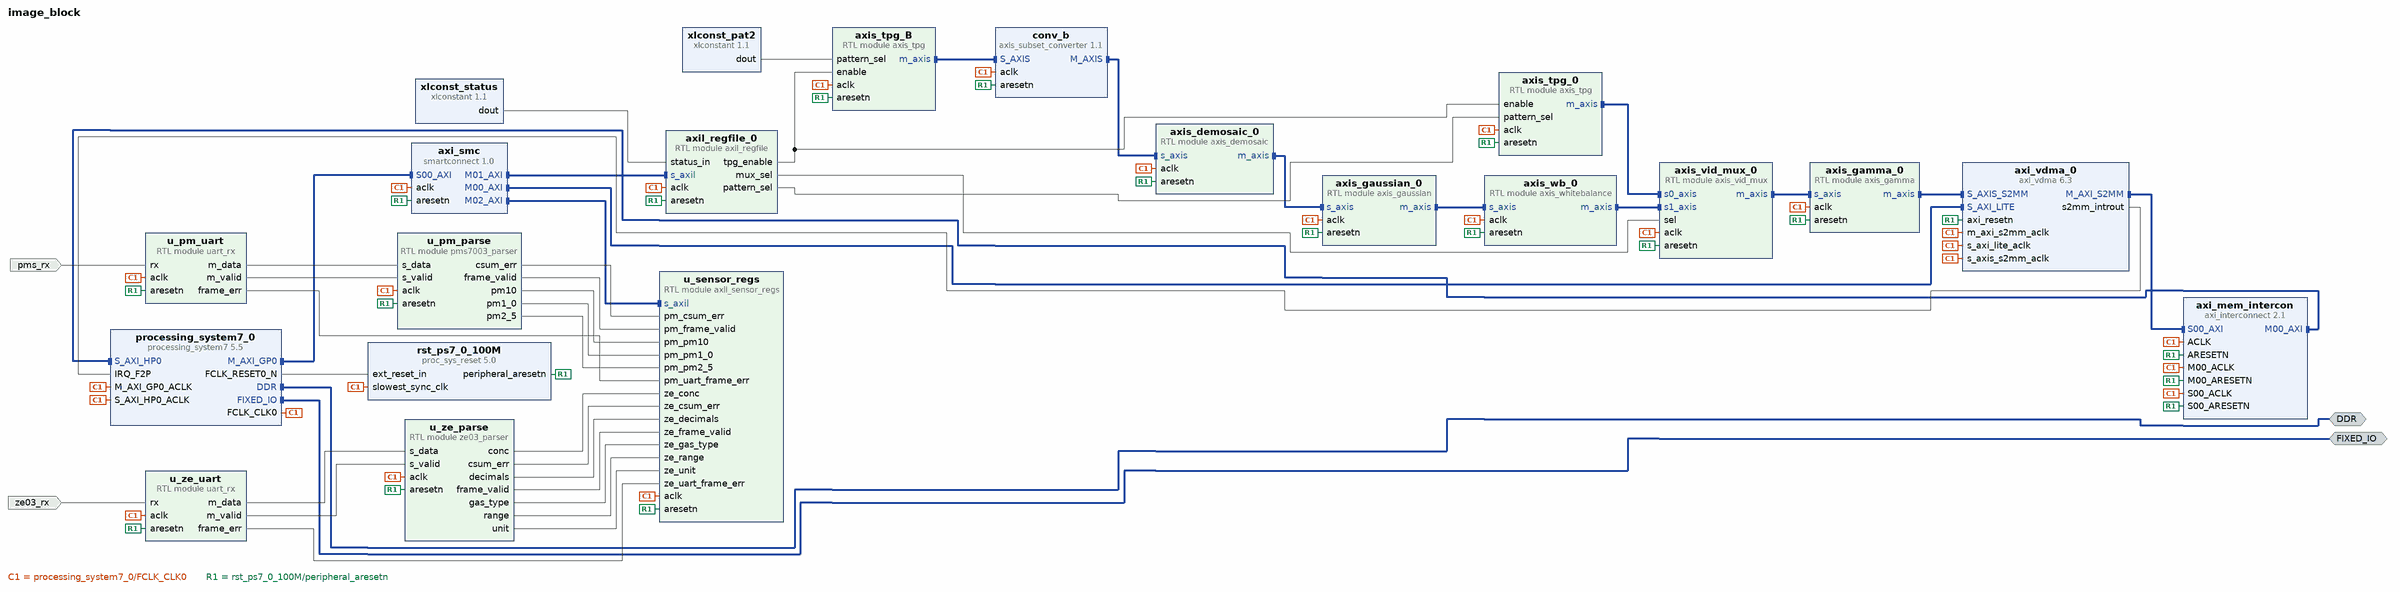
[diagram p0: block diagram of the top level]
# Vivado block design image_block, xc7z020clg400-1, Vivado 2025.2
create_bd_design image_block

create_bd_intf_port -mode Master -vlnv xilinx.com:interface:ddrx_rtl:1.0 DDR
create_bd_intf_port -mode Master -vlnv xilinx.com:display_processing_system7:fixedio_rtl:1.0 FIXED_IO
create_bd_port -dir I ze03_rx
create_bd_port -dir I pms_rx

create_bd_cell -type ip -vlnv xilinx.com:ip:processing_system7:5.5 processing_system7_0
set_property -dict [list \
  CONFIG.PCW_APU_PERIPHERAL_FREQMHZ 666.666666 \
  CONFIG.PCW_ENET0_ENET0_IO {MIO 16 .. 27} \
  CONFIG.PCW_ENET0_GRP_MDIO_ENABLE 1 \
  CONFIG.PCW_ENET0_GRP_MDIO_IO {MIO 52 .. 53} \
  CONFIG.PCW_ENET0_PERIPHERAL_ENABLE 1 \
  CONFIG.PCW_ENET0_RESET_ENABLE 0 \
  CONFIG.PCW_ENET_RESET_ENABLE 1 \
  CONFIG.PCW_ENET_RESET_SELECT {Share reset pin} \
  CONFIG.PCW_FPGA0_PERIPHERAL_FREQMHZ 100 \
  CONFIG.PCW_GPIO_MIO_GPIO_ENABLE 1 \
  CONFIG.PCW_GPIO_MIO_GPIO_IO MIO \
  CONFIG.PCW_I2C0_GRP_INT_ENABLE 0 \
  CONFIG.PCW_I2C0_I2C0_IO {MIO 10 .. 11} \
  CONFIG.PCW_I2C0_PERIPHERAL_ENABLE 1 \
  CONFIG.PCW_I2C_PERIPHERAL_FREQMHZ 111.111115 \
  CONFIG.PCW_I2C_RESET_ENABLE 1 \
  CONFIG.PCW_I2C_RESET_SELECT {Share reset pin} \
  CONFIG.PCW_IRQ_F2P_INTR 1 \
  CONFIG.PCW_PRESET_BANK1_VOLTAGE {LVCMOS 1.8V} \
  CONFIG.PCW_QSPI_GRP_FBCLK_ENABLE 1 \
  CONFIG.PCW_QSPI_GRP_FBCLK_IO {MIO 8} \
  CONFIG.PCW_QSPI_GRP_SINGLE_SS_ENABLE 1 \
  CONFIG.PCW_QSPI_GRP_SINGLE_SS_IO {MIO 1 .. 6} \
  CONFIG.PCW_QSPI_PERIPHERAL_ENABLE 1 \
  CONFIG.PCW_QSPI_QSPI_IO {MIO 1 .. 6} \
  CONFIG.PCW_SD0_GRP_CD_ENABLE 1 \
  CONFIG.PCW_SD0_GRP_CD_IO {MIO 47} \
  CONFIG.PCW_SD0_GRP_WP_ENABLE 0 \
  CONFIG.PCW_SD0_PERIPHERAL_ENABLE 1 \
  CONFIG.PCW_SD0_SD0_IO {MIO 40 .. 45} \
  CONFIG.PCW_SDIO_PERIPHERAL_FREQMHZ 50 \
  CONFIG.PCW_SINGLE_QSPI_DATA_MODE x4 \
  CONFIG.PCW_UART1_PERIPHERAL_ENABLE 1 \
  CONFIG.PCW_UART1_UART1_IO {MIO 48 .. 49} \
  CONFIG.PCW_UART_PERIPHERAL_FREQMHZ 100 \
  CONFIG.PCW_UIPARAM_DDR_FREQ_MHZ 533.333333 \
  CONFIG.PCW_UIPARAM_DDR_MEMORY_TYPE {DDR 3 (Low Voltage)} \
  CONFIG.PCW_UIPARAM_DDR_PARTNO {MT41K256M16 RE-125} \
  CONFIG.PCW_USB0_PERIPHERAL_ENABLE 1 \
  CONFIG.PCW_USB0_RESET_ENABLE 1 \
  CONFIG.PCW_USB0_RESET_IO {MIO 46} \
  CONFIG.PCW_USB0_USB0_IO {MIO 28 .. 39} \
  CONFIG.PCW_USB_RESET_ENABLE 1 \
  CONFIG.PCW_USB_RESET_SELECT {Share reset pin} \
  CONFIG.PCW_USE_FABRIC_INTERRUPT 1 \
  CONFIG.PCW_USE_S_AXI_HP0 1 \
] [get_bd_cells processing_system7_0]
# 298 more settings of processing_system7_0 are not shown: defaults, MIO pin electricals, DDR timing, and values the tool derives
create_bd_cell -type module -reference axis_tpg axis_tpg_0
set_property -dict {CONFIG.H_ACTIVE 64 CONFIG.V_ACTIVE 48} [get_bd_cells axis_tpg_0]
create_bd_cell -type ip -vlnv xilinx.com:ip:axi_vdma:6.3 axi_vdma_0
set_property -dict [list \
  CONFIG.c_addr_width 32 \
  CONFIG.c_include_mm2s 0 \
  CONFIG.c_include_s2mm 1 \
  CONFIG.c_m_axi_s2mm_data_width 64 \
] [get_bd_cells axi_vdma_0]
create_bd_cell -type ip -vlnv xilinx.com:ip:smartconnect:1.0 axi_smc
set_property -dict {CONFIG.NUM_MI 3 CONFIG.NUM_SI 1} [get_bd_cells axi_smc]
create_bd_cell -type ip -vlnv xilinx.com:ip:proc_sys_reset:5.0 rst_ps7_0_100M
create_bd_cell -type ip -vlnv xilinx.com:ip:axi_interconnect:2.1 axi_mem_intercon
set_property -dict {CONFIG.NUM_MI 1} [get_bd_cells axi_mem_intercon]
create_bd_cell -type module -reference axil_regfile axil_regfile_0
set_property -dict {CONFIG.ADDR_WIDTH 12} [get_bd_cells axil_regfile_0]
create_bd_cell -type ip -vlnv xilinx.com:ip:xlconstant:1.1 xlconst_status
set_property -dict {CONFIG.CONST_VAL 0 CONFIG.CONST_WIDTH 32} [get_bd_cells xlconst_status]
create_bd_cell -type module -reference axis_tpg axis_tpg_B
set_property -dict {CONFIG.H_ACTIVE 64 CONFIG.V_ACTIVE 48} [get_bd_cells axis_tpg_B]
create_bd_cell -type module -reference axis_demosaic axis_demosaic_0
set_property -dict {CONFIG.H_ACTIVE 64 CONFIG.V_ACTIVE 48} [get_bd_cells axis_demosaic_0]
create_bd_cell -type module -reference axis_vid_mux axis_vid_mux_0
create_bd_cell -type module -reference axis_gamma axis_gamma_0
set_property -dict {CONFIG.LUT_FILE C:/Users/user/Desktop/project/BARN_AI_FPGA_PL/rtl/gamma_lut.mem} [get_bd_cells axis_gamma_0]
create_bd_cell -type ip -vlnv xilinx.com:ip:xlconstant:1.1 xlconst_pat2
set_property -dict {CONFIG.CONST_VAL 2 CONFIG.CONST_WIDTH 2} [get_bd_cells xlconst_pat2]
create_bd_cell -type ip -vlnv xilinx.com:ip:axis_subset_converter:1.1 conv_b
set_property -dict [list \
  CONFIG.M_HAS_TKEEP 0 \
  CONFIG.M_HAS_TLAST 1 \
  CONFIG.M_HAS_TREADY 1 \
  CONFIG.M_HAS_TSTRB 0 \
  CONFIG.M_TDATA_NUM_BYTES 1 \
  CONFIG.M_TDEST_WIDTH 0 \
  CONFIG.M_TID_WIDTH 0 \
  CONFIG.M_TUSER_WIDTH 1 \
  CONFIG.S_HAS_TKEEP 0 \
  CONFIG.S_HAS_TLAST 1 \
  CONFIG.S_HAS_TREADY 1 \
  CONFIG.S_HAS_TSTRB 0 \
  CONFIG.S_TDATA_NUM_BYTES 3 \
  CONFIG.S_TDEST_WIDTH 0 \
  CONFIG.S_TID_WIDTH 0 \
  CONFIG.S_TUSER_WIDTH 1 \
  CONFIG.TDATA_REMAP {tdata[7:0]} \
] [get_bd_cells conv_b]
create_bd_cell -type module -reference axis_gaussian axis_gaussian_0
set_property -dict {CONFIG.H_ACTIVE 64 CONFIG.V_ACTIVE 48} [get_bd_cells axis_gaussian_0]
create_bd_cell -type module -reference axis_whitebalance axis_wb_0
create_bd_cell -type module -reference uart_rx u_ze_uart
create_bd_cell -type module -reference uart_rx u_pm_uart
create_bd_cell -type module -reference ze03_parser u_ze_parse
create_bd_cell -type module -reference pms7003_parser u_pm_parse
create_bd_cell -type module -reference axil_sensor_regs u_sensor_regs
set_property -dict {CONFIG.ADDR_WIDTH 12} [get_bd_cells u_sensor_regs]

# ---- connections ----

connect_bd_intf_net [get_bd_intf_pins axi_mem_intercon/M00_AXI] [get_bd_intf_pins processing_system7_0/S_AXI_HP0]
connect_bd_intf_net [get_bd_intf_pins axi_smc/M00_AXI] [get_bd_intf_pins axi_vdma_0/S_AXI_LITE]
connect_bd_intf_net [get_bd_intf_pins axi_smc/M01_AXI] [get_bd_intf_pins axil_regfile_0/s_axil]
connect_bd_intf_net [get_bd_intf_pins axi_smc/M02_AXI] [get_bd_intf_pins u_sensor_regs/s_axil]
connect_bd_intf_net [get_bd_intf_pins axi_vdma_0/M_AXI_S2MM] [get_bd_intf_pins axi_mem_intercon/S00_AXI]
connect_bd_intf_net [get_bd_intf_pins axis_demosaic_0/m_axis] [get_bd_intf_pins axis_gaussian_0/s_axis]
connect_bd_intf_net [get_bd_intf_pins axis_gamma_0/m_axis] [get_bd_intf_pins axi_vdma_0/S_AXIS_S2MM]
connect_bd_intf_net [get_bd_intf_pins axis_gaussian_0/m_axis] [get_bd_intf_pins axis_wb_0/s_axis]
connect_bd_intf_net [get_bd_intf_pins axis_tpg_0/m_axis] [get_bd_intf_pins axis_vid_mux_0/s0_axis]
connect_bd_intf_net [get_bd_intf_pins axis_tpg_B/m_axis] [get_bd_intf_pins conv_b/S_AXIS]
connect_bd_intf_net [get_bd_intf_pins axis_vid_mux_0/m_axis] [get_bd_intf_pins axis_gamma_0/s_axis]
connect_bd_intf_net [get_bd_intf_pins axis_wb_0/m_axis] [get_bd_intf_pins axis_vid_mux_0/s1_axis]
connect_bd_intf_net [get_bd_intf_pins conv_b/M_AXIS] [get_bd_intf_pins axis_demosaic_0/s_axis]
connect_bd_intf_net [get_bd_intf_ports DDR] [get_bd_intf_pins processing_system7_0/DDR]
connect_bd_intf_net [get_bd_intf_ports FIXED_IO] [get_bd_intf_pins processing_system7_0/FIXED_IO]
connect_bd_intf_net [get_bd_intf_pins processing_system7_0/M_AXI_GP0] [get_bd_intf_pins axi_smc/S00_AXI]
connect_bd_net [get_bd_pins axi_vdma_0/s2mm_introut] [get_bd_pins processing_system7_0/IRQ_F2P]
connect_bd_net [get_bd_pins axil_regfile_0/mux_sel] [get_bd_pins axis_vid_mux_0/sel]
connect_bd_net [get_bd_ports pms_rx] [get_bd_pins u_pm_uart/rx]
connect_bd_net [get_bd_pins processing_system7_0/FCLK_CLK0] \
  [get_bd_pins processing_system7_0/M_AXI_GP0_ACLK] [get_bd_pins axi_smc/aclk] [get_bd_pins axi_vdma_0/s_axi_lite_aclk] \
  [get_bd_pins rst_ps7_0_100M/slowest_sync_clk] [get_bd_pins axi_vdma_0/m_axi_s2mm_aclk] \
  [get_bd_pins axi_mem_intercon/S00_ACLK] [get_bd_pins processing_system7_0/S_AXI_HP0_ACLK] \
  [get_bd_pins axi_mem_intercon/M00_ACLK] [get_bd_pins axi_mem_intercon/ACLK] [get_bd_pins axis_tpg_0/aclk] \
  [get_bd_pins axi_vdma_0/s_axis_s2mm_aclk] [get_bd_pins axil_regfile_0/aclk] [get_bd_pins axis_tpg_B/aclk] \
  [get_bd_pins axis_demosaic_0/aclk] [get_bd_pins axis_vid_mux_0/aclk] [get_bd_pins axis_gamma_0/aclk] \
  [get_bd_pins conv_b/aclk] [get_bd_pins axis_gaussian_0/aclk] [get_bd_pins axis_wb_0/aclk] [get_bd_pins u_ze_uart/aclk] \
  [get_bd_pins u_pm_uart/aclk] [get_bd_pins u_ze_parse/aclk] [get_bd_pins u_pm_parse/aclk] [get_bd_pins u_sensor_regs/aclk]
connect_bd_net [get_bd_pins processing_system7_0/FCLK_RESET0_N] [get_bd_pins rst_ps7_0_100M/ext_reset_in]
connect_bd_net [get_bd_pins rst_ps7_0_100M/peripheral_aresetn] \
  [get_bd_pins axi_vdma_0/axi_resetn] [get_bd_pins axi_smc/aresetn] [get_bd_pins axi_mem_intercon/S00_ARESETN] \
  [get_bd_pins axi_mem_intercon/M00_ARESETN] [get_bd_pins axi_mem_intercon/ARESETN] [get_bd_pins axis_tpg_0/aresetn] \
  [get_bd_pins axil_regfile_0/aresetn] [get_bd_pins axis_tpg_B/aresetn] [get_bd_pins axis_demosaic_0/aresetn] \
  [get_bd_pins axis_vid_mux_0/aresetn] [get_bd_pins axis_gamma_0/aresetn] [get_bd_pins conv_b/aresetn] \
  [get_bd_pins axis_gaussian_0/aresetn] [get_bd_pins axis_wb_0/aresetn] [get_bd_pins u_ze_uart/aresetn] \
  [get_bd_pins u_pm_uart/aresetn] [get_bd_pins u_ze_parse/aresetn] [get_bd_pins u_pm_parse/aresetn] \
  [get_bd_pins u_sensor_regs/aresetn]
connect_bd_net [get_bd_pins u_pm_parse/csum_err] [get_bd_pins u_sensor_regs/pm_csum_err]
connect_bd_net [get_bd_pins u_pm_parse/frame_valid] [get_bd_pins u_sensor_regs/pm_frame_valid]
connect_bd_net [get_bd_pins u_pm_parse/pm10] [get_bd_pins u_sensor_regs/pm_pm10]
connect_bd_net [get_bd_pins u_pm_parse/pm1_0] [get_bd_pins u_sensor_regs/pm_pm1_0]
connect_bd_net [get_bd_pins u_pm_parse/pm2_5] [get_bd_pins u_sensor_regs/pm_pm2_5]
connect_bd_net [get_bd_pins u_pm_uart/frame_err] [get_bd_pins u_sensor_regs/pm_uart_frame_err]
connect_bd_net [get_bd_pins u_pm_uart/m_data] [get_bd_pins u_pm_parse/s_data]
connect_bd_net [get_bd_pins u_pm_uart/m_valid] [get_bd_pins u_pm_parse/s_valid]
connect_bd_net [get_bd_pins u_ze_parse/conc] [get_bd_pins u_sensor_regs/ze_conc]
connect_bd_net [get_bd_pins u_ze_parse/csum_err] [get_bd_pins u_sensor_regs/ze_csum_err]
connect_bd_net [get_bd_pins u_ze_parse/decimals] [get_bd_pins u_sensor_regs/ze_decimals]
connect_bd_net [get_bd_pins u_ze_parse/frame_valid] [get_bd_pins u_sensor_regs/ze_frame_valid]
connect_bd_net [get_bd_pins u_ze_parse/gas_type] [get_bd_pins u_sensor_regs/ze_gas_type]
connect_bd_net [get_bd_pins u_ze_parse/range] [get_bd_pins u_sensor_regs/ze_range]
connect_bd_net [get_bd_pins u_ze_parse/unit] [get_bd_pins u_sensor_regs/ze_unit]
connect_bd_net [get_bd_pins u_ze_uart/frame_err] [get_bd_pins u_sensor_regs/ze_uart_frame_err]
connect_bd_net [get_bd_pins u_ze_uart/m_data] [get_bd_pins u_ze_parse/s_data]
connect_bd_net [get_bd_pins u_ze_uart/m_valid] [get_bd_pins u_ze_parse/s_valid]
connect_bd_net [get_bd_pins xlconst_pat2/dout] [get_bd_pins axis_tpg_B/pattern_sel]
connect_bd_net [get_bd_pins xlconst_status/dout] [get_bd_pins axil_regfile_0/status_in]
connect_bd_net -net xlconstant_0_dout [get_bd_pins axil_regfile_0/tpg_enable] [get_bd_pins axis_tpg_0/enable] [get_bd_pins axis_tpg_B/enable]
connect_bd_net -net xlconstant_1_dout [get_bd_pins axil_regfile_0/pattern_sel] [get_bd_pins axis_tpg_0/pattern_sel]
connect_bd_net [get_bd_ports ze03_rx] [get_bd_pins u_ze_uart/rx]

# ---- address map ----
assign_bd_address -offset 0x00000000 -range 1G -target_address_space [get_bd_addr_spaces axi_vdma_0/Data_S2MM] [get_bd_addr_segs processing_system7_0/S_AXI_HP0/HP0_DDR_LOWOCM]
assign_bd_address -offset 0x43000000 -range 64K -target_address_space [get_bd_addr_spaces processing_system7_0/Data] [get_bd_addr_segs axi_vdma_0/S_AXI_LITE/Reg]
assign_bd_address -offset 0x43C00000 -range 4K -target_address_space [get_bd_addr_spaces processing_system7_0/Data] [get_bd_addr_segs axil_regfile_0/s_axil/reg0]
assign_bd_address -offset 0x43C10000 -range 4K -target_address_space [get_bd_addr_spaces processing_system7_0/Data] [get_bd_addr_segs u_sensor_regs/s_axil/reg0]

validate_bd_design
save_bd_design
